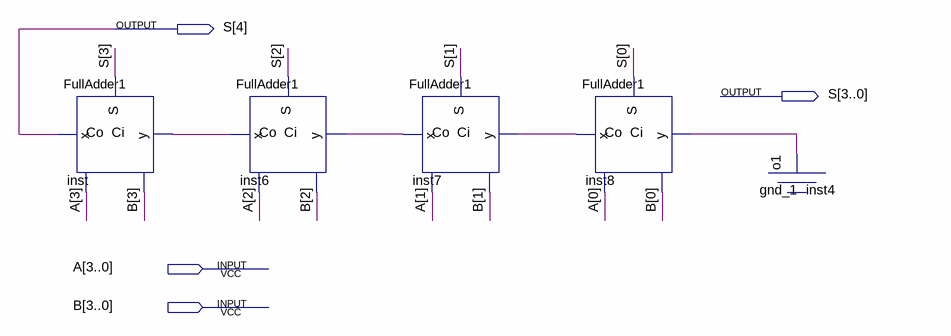
[diagram p0: schematic sheet]
// Quartus schematic FullAdder4.bdf as structural Verilog: 5 symbols, 4 pins
module FullAdder4 (
  input  [3:0] A,
  input  [3:0] B,
  output [4:0] S
);

  wire inst4_o1, inst6_co, inst7_co, inst8_co;

  FullAdder1 inst (.x(A[3]), .y(B[3]), .Ci(inst6_co), .Co(S[4]), .S(S[3]));
  FullAdder1 inst6 (.x(A[2]), .y(B[2]), .Ci(inst7_co), .Co(inst6_co), .S(S[2]));
  FullAdder1 inst7 (.x(A[1]), .y(B[1]), .Ci(inst8_co), .Co(inst7_co), .S(S[1]));
  FullAdder1 inst8 (.x(A[0]), .y(B[0]), .Ci(inst4_o1), .Co(inst8_co), .S(S[0]));
  gnd_1 inst4 (.o1(inst4_o1));
endmodule
